# Altium schematic sheet Sch_Dr_PWM_Out .SchDoc
size A4; Organization: Altium Limited; Address1: L3, 12a Rodborough Rd; Address2: Frenchs Forest; Address3: NSW; Address4: Australia 2086
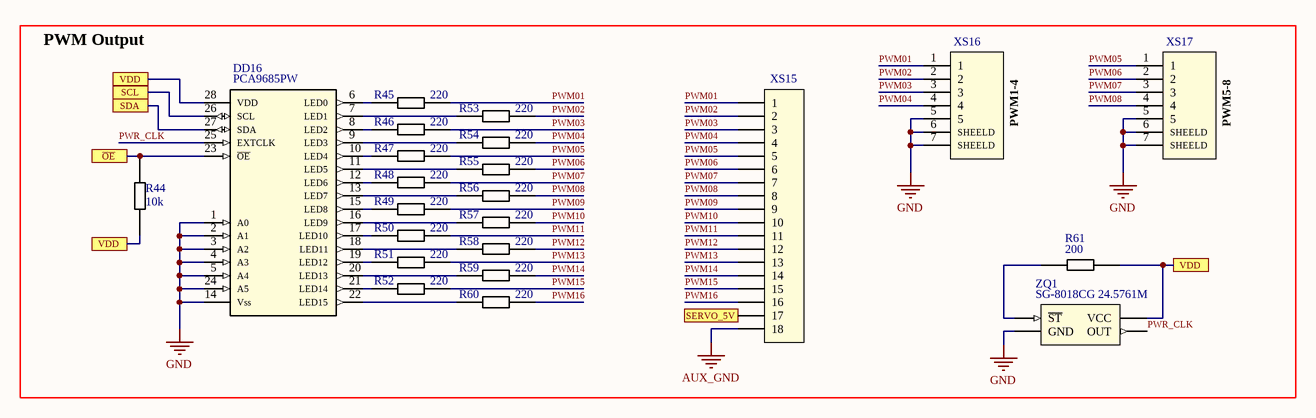
[diagram p0: Sch_Dr_PWM_Out .SchDoc]

## Parts
DD16  PCA9685PW  [TSSOP28]
R44  10k  [Res_0603]
R45  220  [Res_0603]
R46  220  [Res_0603]
R47  220  [Res_0603]
R48  220  [Res_0603]
R49  220  [Res_0603]
R50  220  [Res_0603]
R51  220  [Res_0603]
R52  220  [Res_0603]
R53  220  [Res_0603]
R54  220  [Res_0603]
R55  220  [Res_0603]
R56  220  [Res_0603]
R57  220  [Res_0603]
R58  220  [Res_0603]
R59  220  [Res_0603]
R60  220  [Res_0603]
R61  200  [Res_0603]
XS15  Servo16x  [Servo16x]  (value not drawn)
XS16  BM05B-GHS-TBT(LF)(SN)(N)  [BM05B-GHS-TBT]  (value not drawn)
XS17  BM05B-GHS-TBT(LF)(SN)(N)  [BM05B-GHS-TBT]  (value not drawn)
ZQ1  SG-8018CG 24.5761M  [SG-8018CG 24.5761M-TJHSA0]

## Ports
SCL, SDA, SERVO_5V, VDD, ~{OE}

## Nets
AUX_GND: XS15.18
GND: DD16.1(A0) DD16.2(A1) DD16.3(A2) DD16.4(A3) DD16.5(A4) DD16.14(Vss) DD16.24(A5) XS16.5 XS16.6(SHEELD) XS16.7(SHEELD) XS17.5 XS17.6(SHEELD) XS17.7(SHEELD) ZQ1.2(GND)
~{OE}: DD16.23(~{OE}) R44.2 ; port ~{OE}
PWM01: R45.2 XS15.1 XS16.1
PWM02: R53.2 XS15.2 XS16.2
PWM03: R46.2 XS15.3 XS16.3
PWM04: R54.2 XS15.4 XS16.4
PWM05: R47.2 XS15.5 XS17.1
PWM06: R55.2 XS15.6 XS17.2
PWM07: R48.2 XS15.7 XS17.3
PWM08: R56.2 XS15.8 XS17.4
PWM09: R49.2 XS15.9
PWM10: R57.2 XS15.10
PWM11: R50.2 XS15.11
PWM12: R58.2 XS15.12
PWM13: R51.2 XS15.13
PWM14: R59.2 XS15.14
PWM15: R52.2 XS15.15
PWM16: R60.2 XS15.16
PWR_CLK: DD16.25(EXTCLK) ZQ1.3(OUT)
SCL: DD16.26(SCL) ; port SCL
SDA: DD16.27(SDA) ; port SDA
SERVO_5V: XS15.17 ; port SERVO_5V
VDD: DD16.28(VDD) R44.1 R61.2 ZQ1.4(VCC) ; port VDD
NetDD16_6: DD16.6(LED0) R45.1
NetDD16_7: DD16.7(LED1) R53.1
NetDD16_8: DD16.8(LED2) R46.1
NetDD16_9: DD16.9(LED3) R54.1
NetDD16_10: DD16.10(LED4) R47.1
NetDD16_11: DD16.11(LED5) R55.1
NetDD16_12: DD16.12(LED6) R48.1
NetDD16_13: DD16.13(LED7) R56.1
NetDD16_15: DD16.15(LED8) R49.1
NetDD16_16: DD16.16(LED9) R57.1
NetDD16_17: DD16.17(LED10) R50.1
NetDD16_18: DD16.18(LED11) R58.1
NetDD16_19: DD16.19(LED12) R51.1
NetDD16_20: DD16.20(LED13) R59.1
NetDD16_21: DD16.21(LED14) R52.1
NetDD16_22: DD16.22(LED15) R60.1
NetR61_1: R61.1 ZQ1.1(~{ST})

## Notes on the sheet
- PWM Output
- PWM1-4
- PWM5-8
- Title
- Size:
- Date:
- A4
- Number:
- Time:
- Revision:
- Sheet
- of
- File:

## Library data of the parts
DD16 = PCA9685PW: 16-ch, 12-bit PWM Fm+ I2C-bus LED controller
R44 = Res_: CR-03FL7---10K
R45-R60 = Res_: CR-03FL7--220R
R61 = Res_: CR-03FL7--200R
XS15 = Servo16x: 16*3
ZQ1 = SG-8018CG 24.5761M: Crystal Oscillator 24.576MHz